# EAGLE design SensorMoteSMT_V1.1MCAD (EAGLE 6.2)

## Sheet 1 of 4
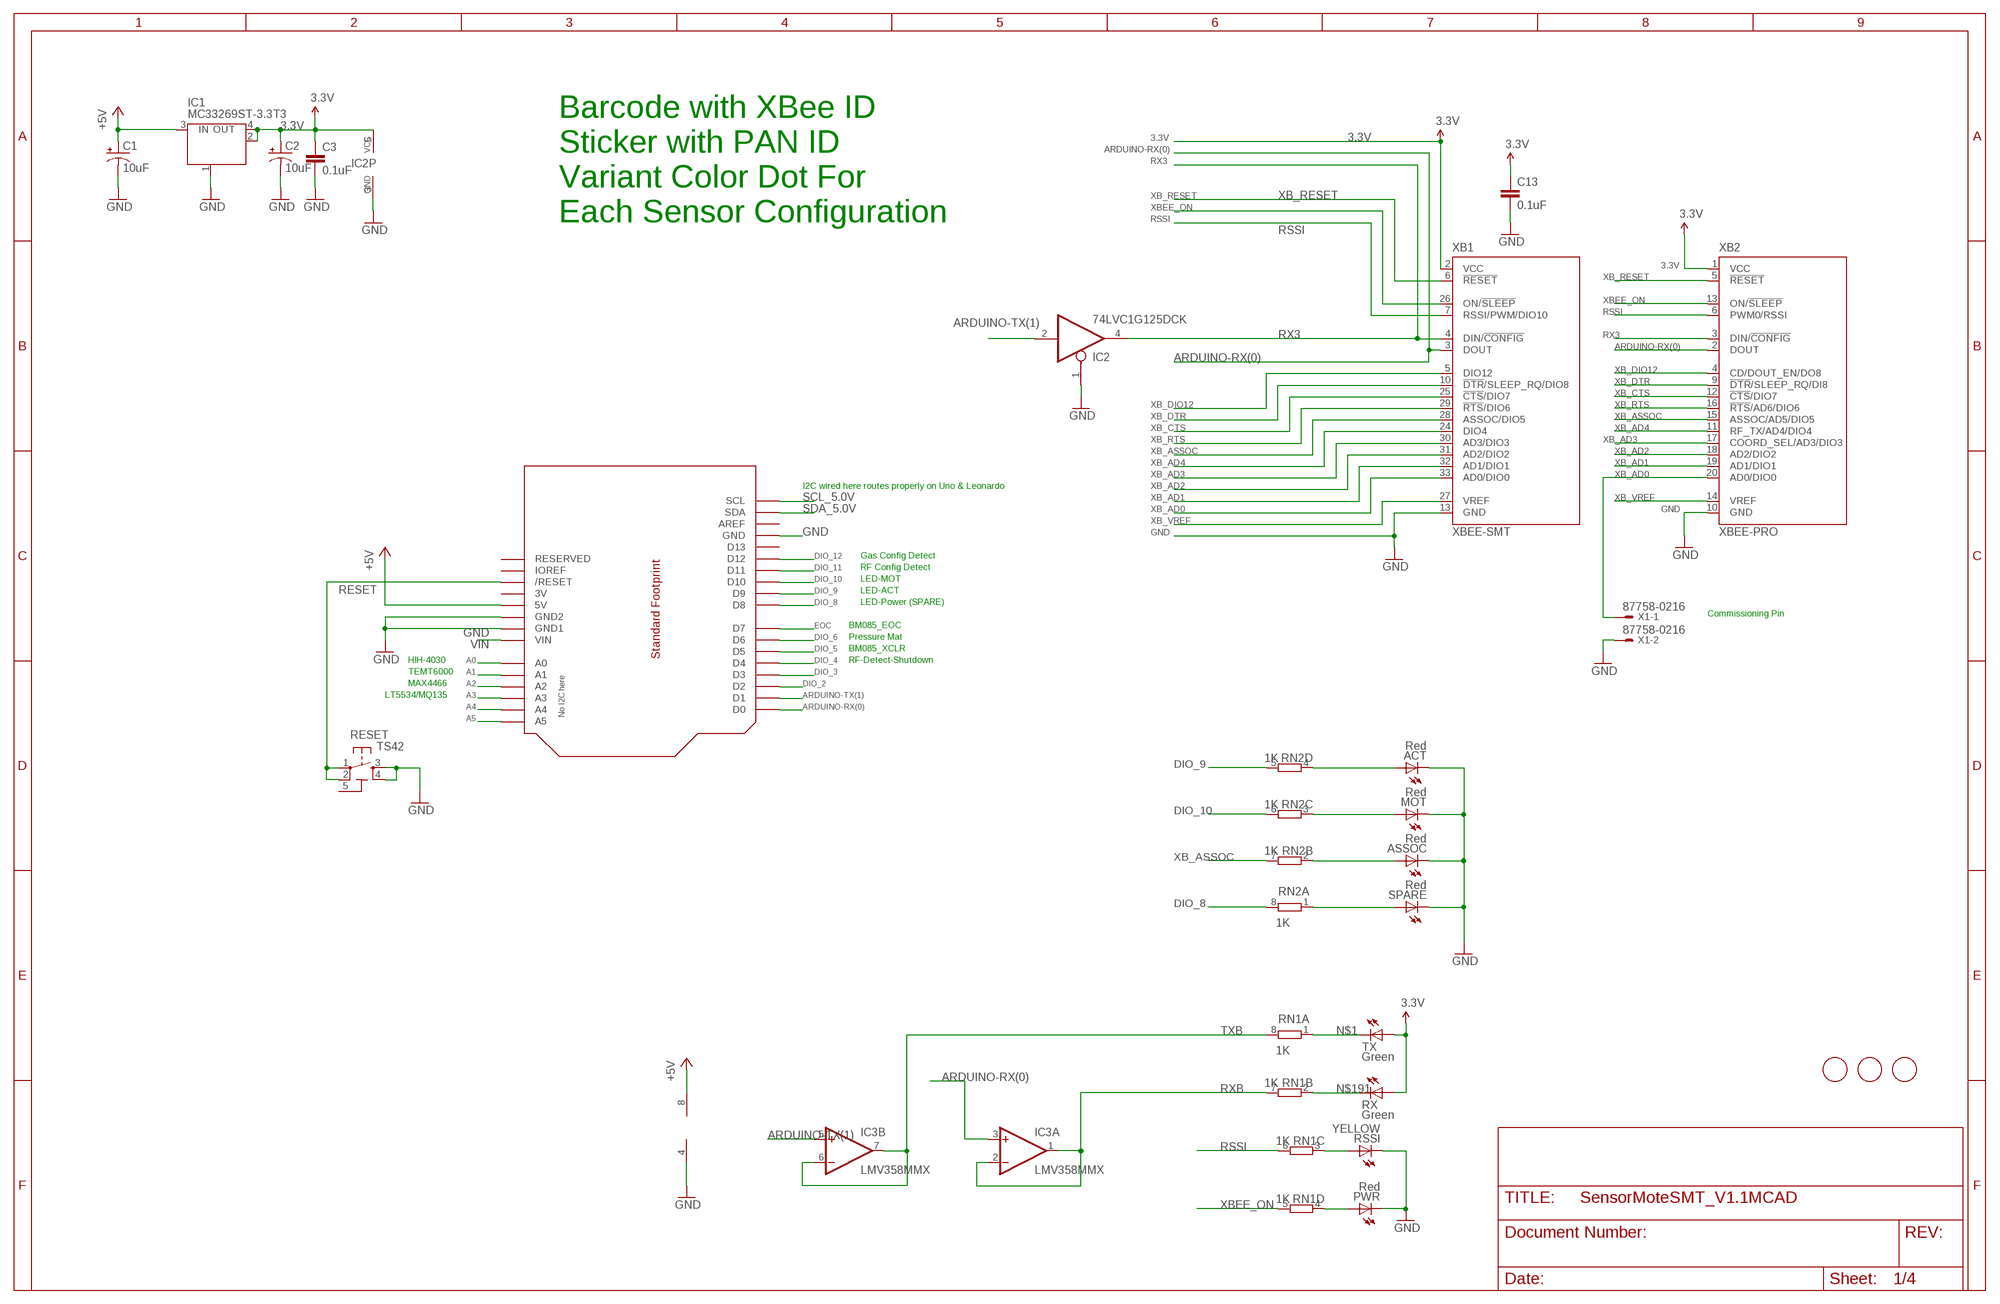
[diagram p0: schematic, sheet 1]

### Parts
A1  FIDUCIALMOUNT  [FIDUCIA-MOUNT]
A2  FIDUCIALMOUNT  [FIDUCIA-MOUNT]
A3  FIDUCIALMOUNT  [FIDUCIA-MOUNT]
ACT  Red  LEDCHIP-LED0805  [CHIP-LED0805]
ASSOC  Red  LEDCHIP-LED0805  [CHIP-LED0805]
C1  10uF  CAP_POL1206  [EIA3216]
C2  10uF  CAP_POL1206  [EIA3216]
C3  0.1uF  C-EUC0805K  [C0805K]
C13  0.1uF  C-EUC0805K  [C0805K]
IC1  MC33269ST-3.3T3  [SOT223]
IC2  74LVC1G125DCK  [SC70-5]
IC3  LMV358MMX  [MSOP08]
MOT  Red  LEDCHIP-LED0805  [CHIP-LED0805]
PWR  Red  LEDCHIP-LED0805  [CHIP-LED0805]
RESET  TS42  [TS42]
RN1  1K  4R-NCAY16  [CAY16]
RN2  1K  4R-NCAY16  [CAY16]
RSSI  YELLOW  LEDCHIP-LED0805  [CHIP-LED0805]
RX  Green  LEDCHIP-LED0805  [CHIP-LED0805]
SPARE  Red  LEDCHIP-LED0805  [CHIP-LED0805]
TX  Green  LEDCHIP-LED0805  [CHIP-LED0805]
U1  ARDUINOR3  [ARDUINOR3_EXTENDED]
X1  87758-0216  [87758-0216]
XB1  XBEE-SMT  [XBEE-SMT]
XB2  XBEE-PRO  [XBEE-PRO]

### Nets
3.3V: C2.A(+) C3.1 C13.1 IC1.2(OUT) IC1.4(OUT) IC2.5(VCC) RX.A TX.A XB1.2(VCC) XB2.1(VCC) ; also sheet 3
+5V: C1.A(+) IC1.3(IN) IC3.8(P:V+) U1.5V ; also sheet 2,3,4
A0: U1.A0 ; also sheet 2
A1: U1.A1 ; also sheet 2
A2: U1.A2 ; also sheet 3
A3: U1.A3 ; also sheet 4
A4: U1.A4
A5: U1.A5
ARDUINO-RX(0): IC3.3(A:+IN) U1.D0 XB1.3(DOUT) XB2.2(DOUT)
ARDUINO-TX(1): IC2.2(I) IC3.5(B:+IN) U1.D1
DIO_2: U1.D2
DIO_3: U1.D3
DIO_4: U1.D4 ; also sheet 4
DIO_5: U1.D5 ; also sheet 3
DIO_6: U1.D6 ; also sheet 4
DIO_8: RN2.8 U1.D8
DIO_9: RN2.5 U1.D9
DIO_10: RN2.6 U1.D10
DIO_11: U1.D11 ; also sheet 4
DIO_12: U1.D12 ; also sheet 4
EOC: U1.D7 ; also sheet 3
GND: ACT.C ASSOC.C C1.C(-) C2.C(-) C3.2 C13.2 IC1.1(GND/ADJ) IC2.1(OE) IC2.3(GND) IC3.4(P:V-) MOT.C PWR.C RESET.3 RESET.4 RSSI.C SPARE.C U1.GND U1.GND1 U1.GND2 X1.2 XB1.13(GND) XB2.10(GND) ; also sheet 2,3,4
N$1: RN1.1 TX.C
N$11: ACT.A RN2.4
N$15: MOT.A RN2.3
N$16: RN1.3 RSSI.A
N$18: ASSOC.A RN2.2
N$19: RN2.1 SPARE.A
N$29: PWR.A RN1.4
N$191: RN1.2 RX.C
RESET: RESET.1 RESET.2 U1.RESET(/RESET)
RSSI: RN1.6 XB1.7(RSSI/PWM/DIO10) XB2.6(PWM0/RSSI)
RX3: IC2.4(O) XB1.4(DIN/!CONFIG) XB2.3(DIN/!CONFIG)
RXB: IC3.1(A:OUT) IC3.2(A:-IN) RN1.7
SCL_5.0V: U1.SCL ; also sheet 3
SDA_5.0V: U1.SDA ; also sheet 3
TXB: IC3.6(B:-IN) IC3.7(B:OUT) RN1.8
VIN: U1.VIN
XB_AD0: X1.1 XB1.33(AD0/DIO0) XB2.20(AD0/DIO0)
XB_AD1: XB1.32(AD1/DIO1) XB2.19(AD1/DIO1)
XB_AD2: XB1.31(AD2/DIO2) XB2.18(AD2/DIO2)
XB_AD3: XB1.30(AD3/DIO3) XB2.17(COORD_SEL/AD3/DIO3)
XB_AD4: XB1.24(DIO4) XB2.11(RF_TX/AD4/DIO4)
XB_ASSOC: RN2.7 XB1.28(ASSOC/DIO5) XB2.15(ASSOC/AD5/DIO5)
XB_CTS: XB1.25(!CTS!/DIO7) XB2.12(!CTS!/DIO7)
XB_DIO12: XB1.5(DIO12) XB2.4(CD/DOUT_EN/DO8)
XB_DTR: XB1.10(!DTR!/SLEEP_RQ/DIO8) XB2.9(!DTR!/SLEEP_RQ/DI8)
XB_RESET: XB1.6(!RESET) XB2.5(!RESET)
XB_RTS: XB1.29(!RTS!/DIO6) XB2.16(!RTS!/AD6/DIO6)
XB_VREF: XB1.27(VREF) XB2.14(VREF)
XBEE_ON: RN1.5 XB1.26(ON/!SLEEP) XB2.13(ON/!SLEEP)
Unconnected: U1.AREF U1.D13 U1.IOREF U1.RESERVED

### Notes on the sheet
- Barcode with XBee ID
- Sticker with PAN ID
- Variant Color Dot For
- Each Sensor Configuration
- I2C wired here routes properly on Uno & Leonardo
- Gas Config Detect
- RF Config Detect
- LED-MOT
- LED-ACT
- LED-Power (SPARE)
- Commissioning Pin
- BM085_EOC
- Pressure Mat
- BM085_XCLR
- HIH-4030 | RF-Detect-Shutdown
- TEMT6000
- MAX4466
- LT5534/MQ135

## Sheet 2 of 4: Sparkfun Parts
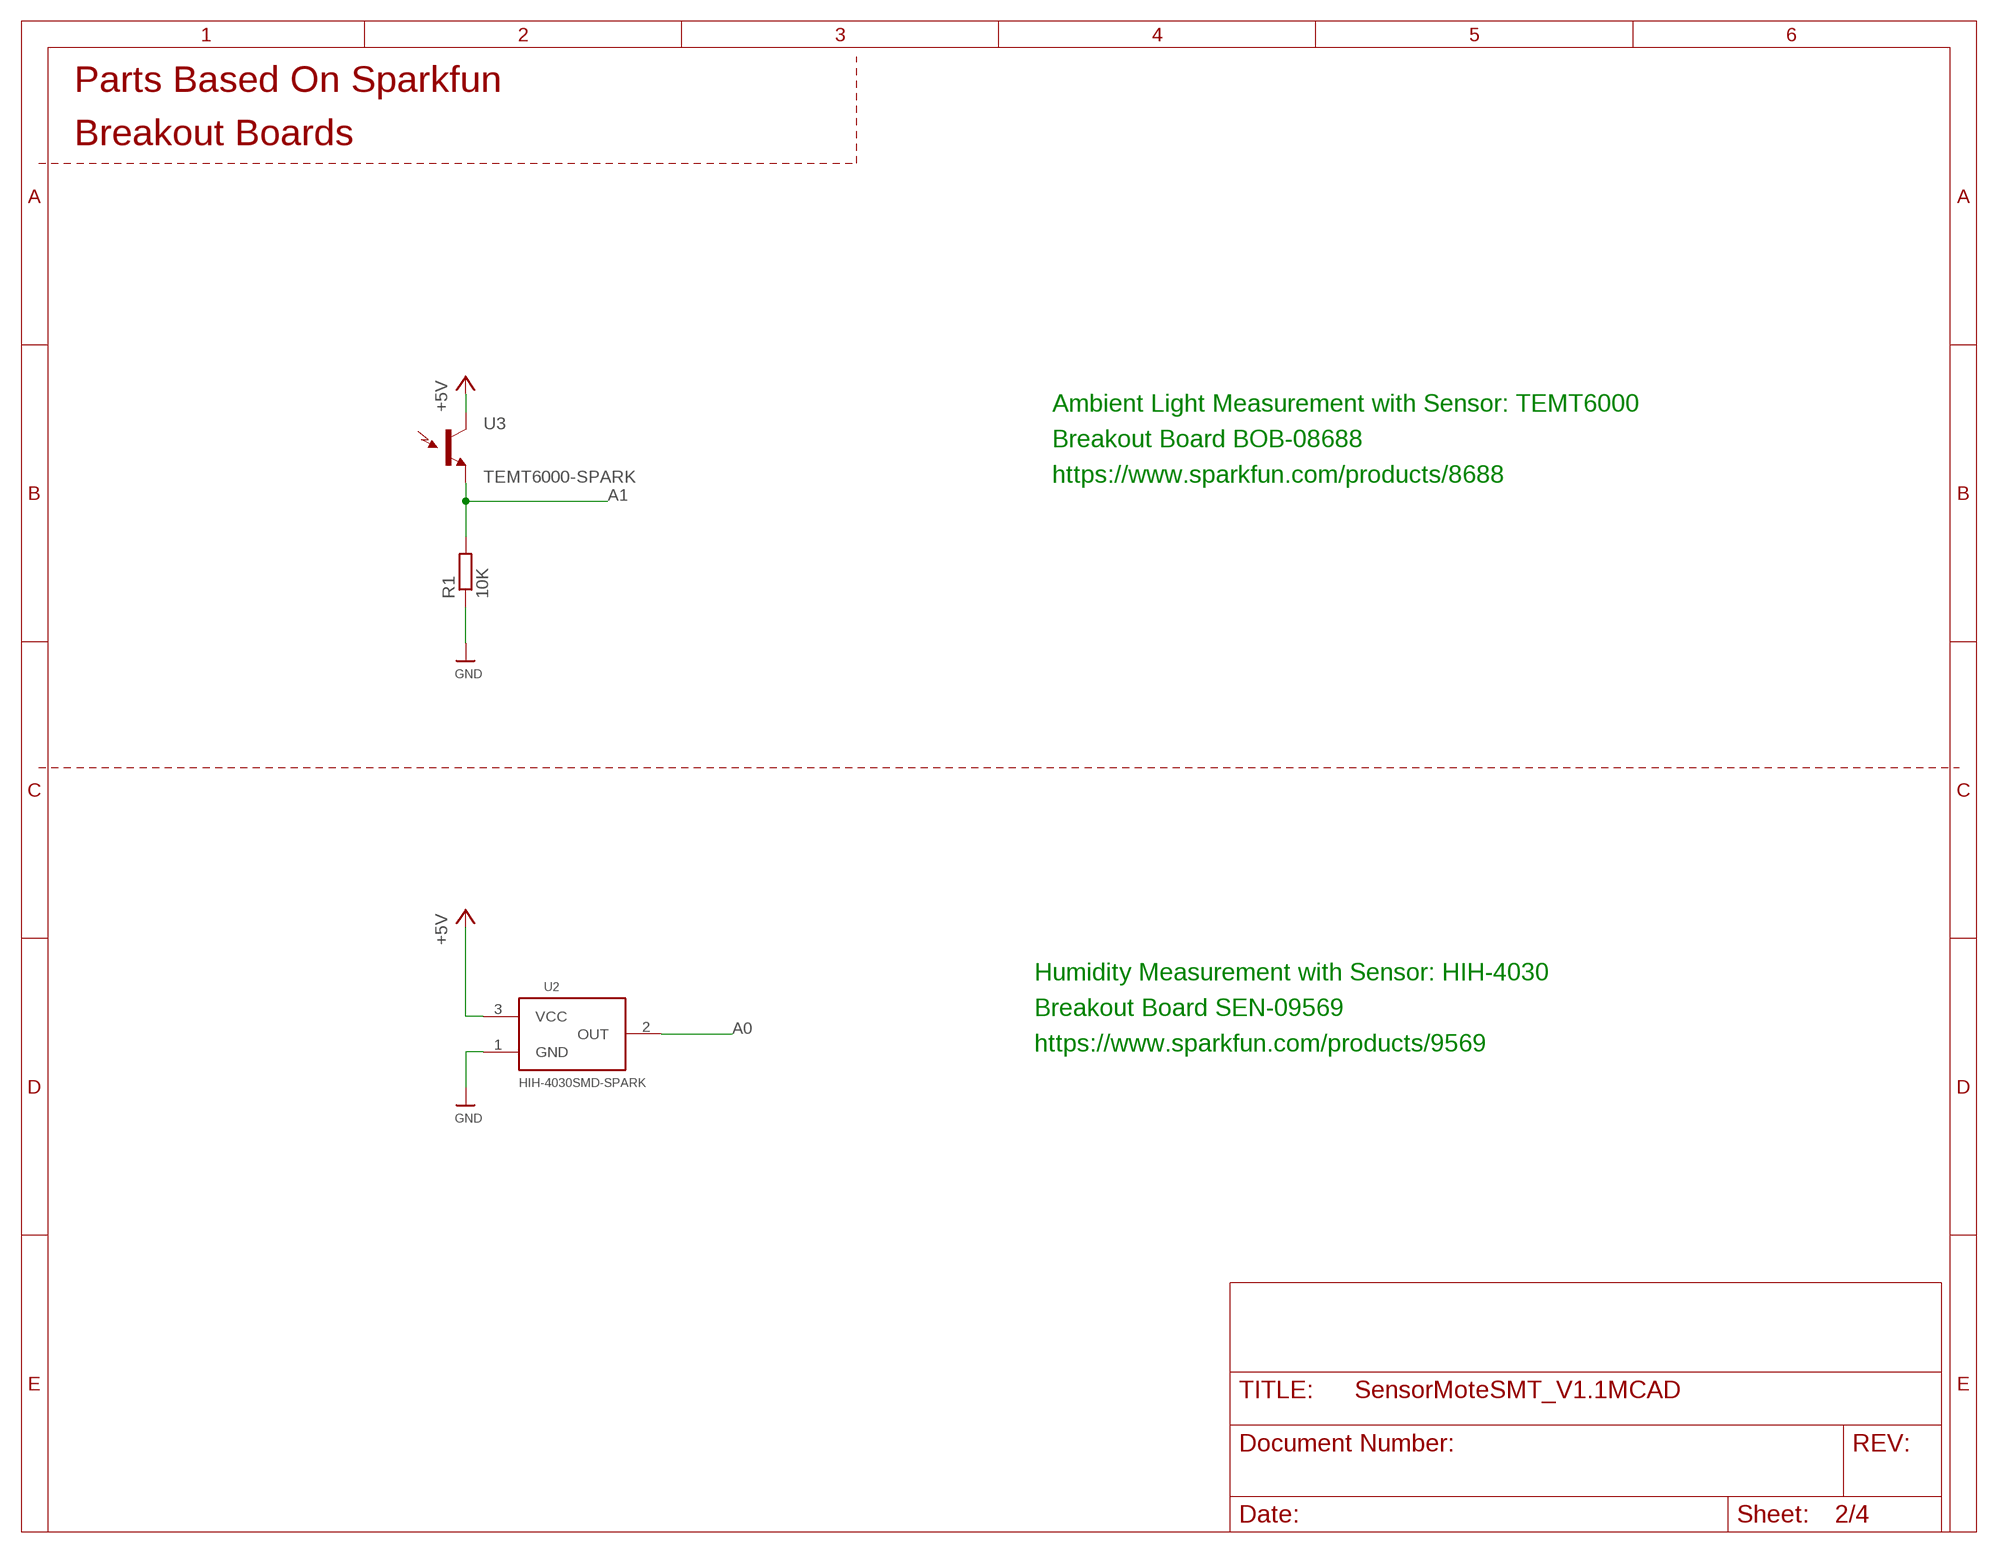
[diagram p1: schematic, sheet 2]

### Parts
R1  10K  R-EU_R0805  [R0805]
U2  HIH-4030SMD-SPARK  HIH-4030SMD  [HIH-4030]
U3  TEMT6000-SPARK  TEMT6000  [TEMT6000-SEN]

### Nets
+5V: U2.3(VCC) U3.COLLECTOR(C1) ; also sheet 1,3,4
A0: U2.2(OUT) ; also sheet 1
A1: R1.2 U3.EMITTER(E1) ; also sheet 1
GND: R1.1 U2.1(GND) ; also sheet 1,3,4

### Notes on the sheet
- Parts Based On Sparkfun
- Breakout Boards
- Ambient Light Measurement with Sensor: TEMT6000
- Breakout Board BOB-08688
- https://www.sparkfun.com/products/8688
- Humidity Measurement with Sensor: HIH-4030
- Breakout Board SEN-09569
- https://www.sparkfun.com/products/9569

## Sheet 3 of 4: Adafruit Parts
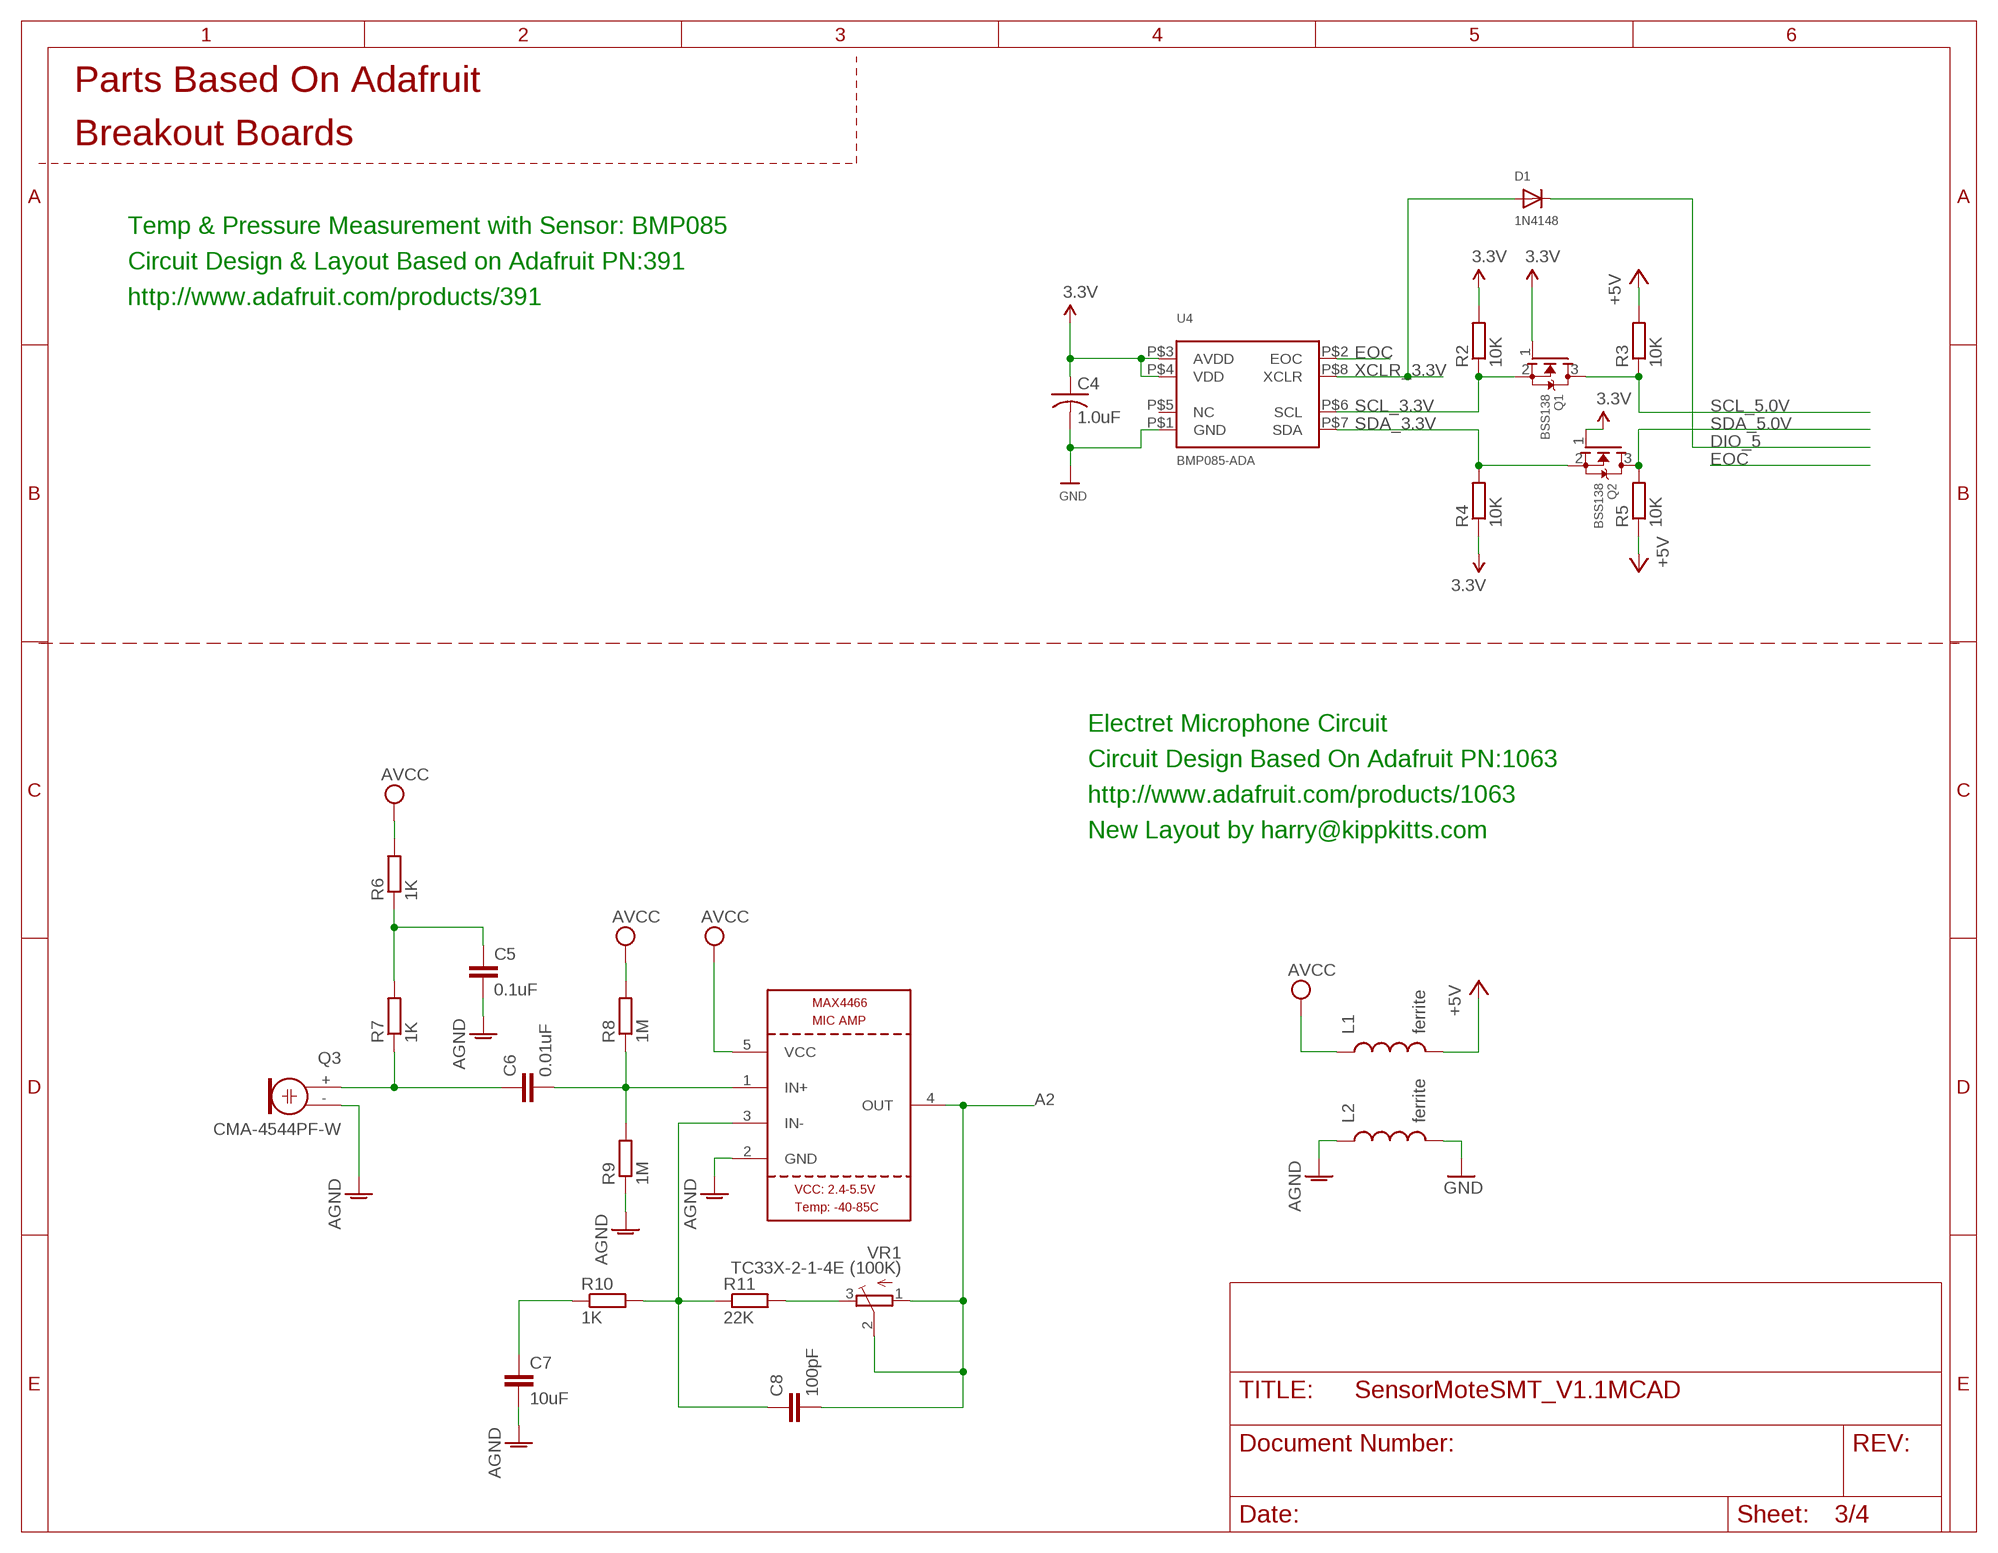
[diagram p2: schematic, sheet 3]

### Parts
C4  1.0uF  C-USC0805K  [C0805K]
C5  0.1uF  C-EUC0805K  [C0805K]
C6  0.01uF  C-EUC0805K  [C0805K]
C7  10uF  C-EUC0805K  [C0805K]
C8  100pF  C-EUC0805K  [C0805K]
D1  1N4148  DIODESOD-323F  [SOD-323F]
L1  ferrite  INDUCTOR0603  [0603]
L2  ferrite  INDUCTOR0603  [0603]
Q1  BSS138  MOSFET-NREFLOW  [SOT23]
Q2  BSS138  MOSFET-NREFLOW  [SOT23]
Q3  CMA-4544PF-W  ELECTRET  [9.7ELECTRET]
R2  10K  R-EU_R0805  [R0805]
R3  10K  R-EU_R0805  [R0805]
R4  10K  R-EU_R0805  [R0805]
R5  10K  R-EU_R0805  [R0805]
R6  1K  R-EU_R0805  [R0805]
R7  1K  R-EU_R0805  [R0805]
R8  1M  R-EU_R0805  [R0805]
R9  1M  R-EU_R0805  [R0805]
R10  1K  R-EU_R0805  [R0805]
R11  22K  R-EU_R0805  [R0805]
U4  BMP085-ADA  BMP085  [BMP085]
U5  MAX4466SC70  [SC70-5L]
VR1  TC33X-2-1-4E (100K)  TRIMPOTTC33X  [TC33X]

### Nets
3.3V: C4.1 Q1.1(G) Q2.1(G) R2.2 R4.1 U4.P$3(AVDD) U4.P$4(VDD) ; also sheet 1
+5V: L1.2 R3.2 R5.1 ; also sheet 1,2,4
A2: C8.2 U5.4(OUT) VR1.1(A) VR1.2(S) ; also sheet 1
AGND: C5.2 C7.2 L2.1 Q3.- R9.1 U5.2(GND)
DIO_5: D1.C ; also sheet 1
EOC: U4.P$2(EOC) ; also sheet 1
GND: C4.2 L2.2 U4.P$1(GND) ; also sheet 1,2,4
N$2: C6.1 Q3.+ R7.1
N$6: C6.2 R8.1 R9.2 U5.1(IN+)
N$7: C5.1 R6.1 R7.2
N$8: C8.1 R10.2 R11.1 U5.3(IN-)
N$9: C7.1 R10.1
N$10: R11.2 VR1.3(E)
SCL_3.3V: Q1.2(S) R2.1 U4.P$6(SCL)
SCL_5.0V: Q1.3(D) R3.1 ; also sheet 1
SDA_3.3V: Q2.2(S) R4.2 U4.P$7(SDA)
SDA_5.0V: Q2.3(D) R5.2 ; also sheet 1
VCC: L1.1 R6.2 R8.2 U5.5(VCC) ; supply symbol labelled AVCC
XCLR_3.3V: D1.A U4.P$8(XCLR)
Unconnected: U4.P$5(NC)

### Notes on the sheet
- Parts Based On Adafruit
- Breakout Boards
- Temp & Pressure Measurement with Sensor: BMP085
- Circuit Design & Layout Based on Adafruit PN:391
- http://www.adafruit.com/products/391
- Electret Microphone Circuit
- Circuit Design Based On Adafruit PN:1063
- http://www.adafruit.com/products/1063
- New Layout by harry@kippkitts.com

## Sheet 4 of 4: Other_Sensors
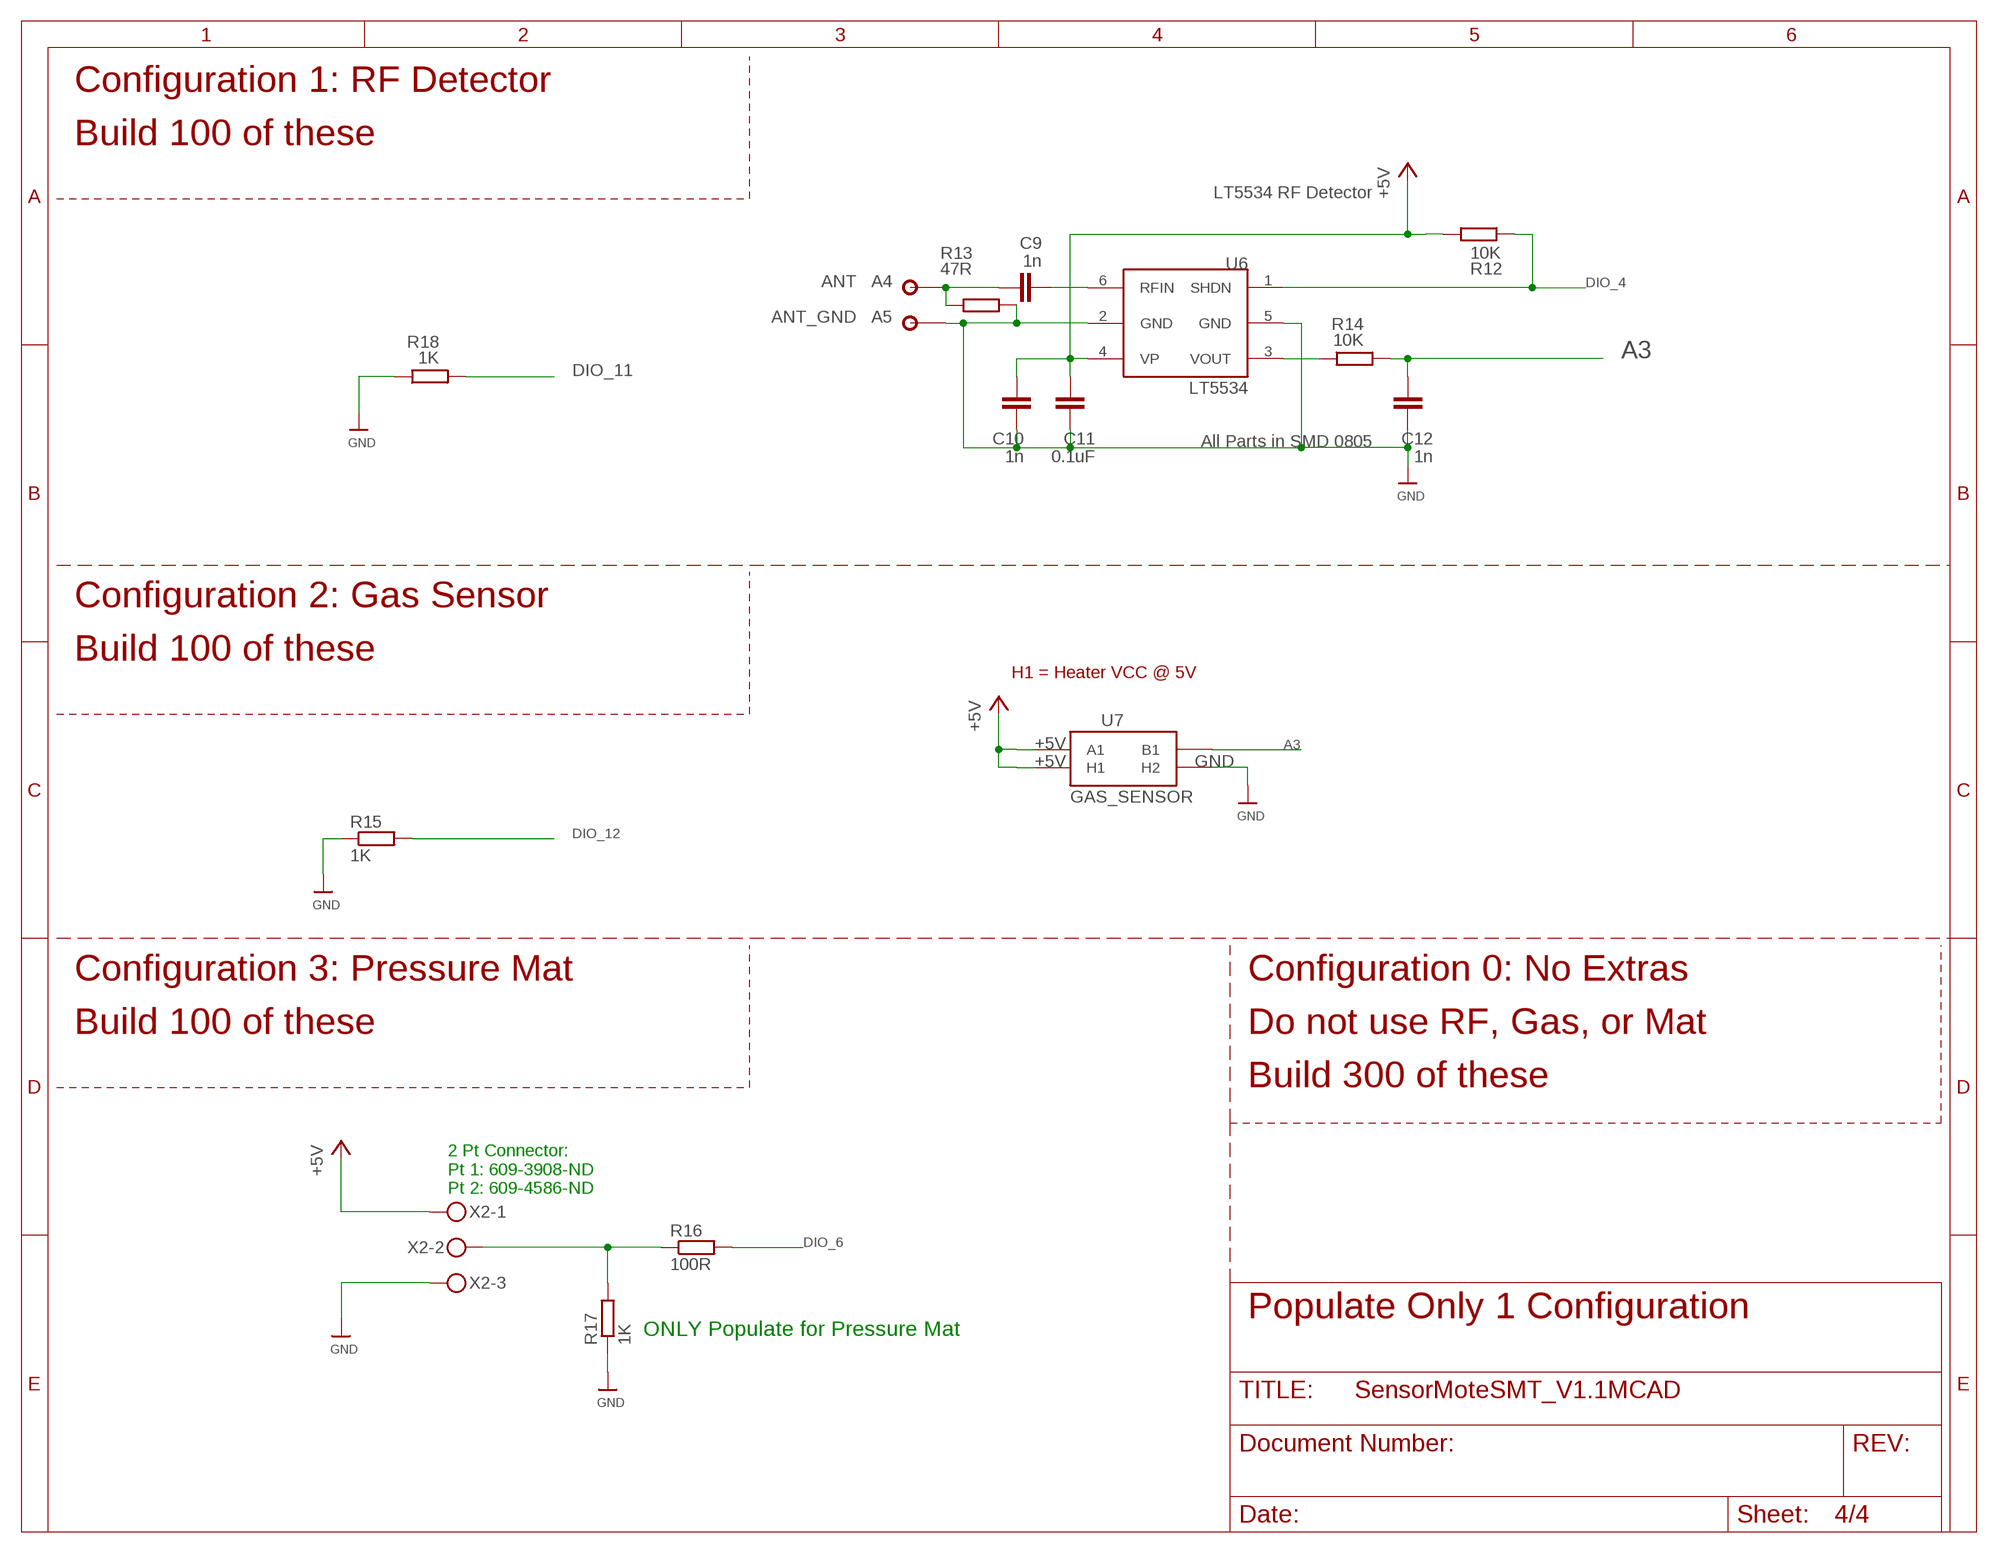
[diagram p3: schematic, sheet 4]

### Parts
A4  ANT  PAD1,46MM  [PAD146]
A5  ANT_GND  PAD1,46MM  [PAD146]
C9  1n  C-EUC0805K  [C0805K]
C10  1n  C-EUC0805K  [C0805K]
C11  0.1uF  C-EUC0805K  [C0805K]
C12  1n  C-EUC0805K  [C0805K]
R12  10K  R-EU_R0805  [R0805]
R13  47R  R-EU_R0805  [R0805]
R14  10K  R-EU_R0805  [R0805]
R15  1K  R-EU_R0805  [R0805]
R16  100R  R-EU_R0805  [R0805]
R17  1K  R-EU_R0805  [R0805]
R18  1K  R-EU_R0805  [R0805]
U6  LT5534  LTC55  [SC70]
U7  GAS_SENSOR  [MQ-3]
X2  MKDSN1,5/3-5,08  [MKDSN1,5/3-5,08]

### Nets
+5V: C10.2 C11.2 R12.2 U6.4(VP) U7.A1 U7.HA(H1) X2.1 ; also sheet 1,2,3
A3: C12.2 R14.2 U7.B1 ; also sheet 1
DIO_4: R12.1 U6.1(SHDN) ; also sheet 1
DIO_6: R16.2 ; also sheet 1
DIO_11: R18.2 ; also sheet 1
DIO_12: R15.2 ; also sheet 1
GND: A5.1 C10.1 C11.1 C12.1 R13.2 R15.1 R17.1 R18.1 U6.2(GND) U6.5(GND) U7.HB(H2) X2.3 ; also sheet 1,2,3
N$12: C9.1 U6.6(RFIN)
N$13: A4.1 C9.2 R13.1
N$14: R14.1 U6.3(VOUT)
N$20: R16.1 R17.2 X2.2

### Notes on the sheet
- Configuration 1: RF Detector
- Build 100 of these
- LT5534 RF Detector
- All Parts in SMD 0805
- Configuration 2: Gas Sensor
- ALSO POPULATE C12 USING 10K RESISTOR
- Build 100 of these
- H1 = Heater VCC @ 5V
- Configuration 3: Pressure Mat | Configuration 0: No Extras
- Build 100 of these | Do not use RF, Gas, or Mat
- Build 300 of these
- 2 Pt Connector:
  Pt 1: 609-3908-ND
  Pt 2: 609-4586-ND
- Populate Only 1 Configuration
- ONLY Populate for Pressure Mat

## Power pins joined to a net without a drawn wire
3V: U1.3V
5-GND: RESET.5(5-GND)

## Library data of the parts
A1-A3 = Smartprj:FIDUCIALMOUNT
A4 A5 = 1martin:PAD
ACT ASSOC MOT PWR RSSI RX SPARE TX = led:LED: LED OSRAM: - CHIPLED LG R971, LG N971, LY N971, LG Q971, LY Q971, LO R971, LY R971 LH N974, LH R974 LS Q976, LO Q976, LY Q976 LO Q996 - Hyper CHIPLED LW Q18S LB Q993, LB Q99A, LB R99A - SideLED LS A670, LO A670, LY A670, LG A670, LP A670 LB A673, LV A673, LT A673, LW A673 LH A674 LY A675 LS A676, LA A676, LO A676, LY A676, LW A676 LS A679, LY A679, LG A679 - Hyper Micro SIDELED® LS Y876, LA Y876, LO Y876, LY Y876 LT Y87S - SmartLED LW L88C, LW L88S LB L89C, LB L89S, LG L890 LS L89K, LO L89K, LY L89K LS L896, LA L896, LO L896, LY L896 - TOPLED LS T670, LO T670, LY T670, LG T670, LP T670 LSG T670, LSP T670, LSY T670, LOP T670, LYG T670 LG T671, LOG T671, LSG T671 LB T673, LV T673, LT T673, LW T673 LH T674 LS T676, LA T676, LO T676, LY T676, LB T676, LH T676, LSB T676, LW T676 LB T67C, LV T67C, LT T67C, LS T67K, LO T67K, LY T67K, LW E67C LS E67B, LA E67B, LO E67B, LY E67B, LB E67C, LV E67C, LT E67C LW T67C LS T679, LY T679, LG T679 LS T770, LO T770, LY T770, LG T770, LP T770 LB T773, LV T773, LT T773, LW T773 LH T774 LS E675, LA E675, LY E675, LS T675 LS T776, LA T776, LO T776, LY T776, LB T776 LHGB T686 LT T68C, LB T68C - Hyper Mini TOPLED® LB M676 - Mini TOPLED Santana® LG M470 LS M47K, LO M47K, LY M47K Source: http://www.osram.convergy.de LUXEON: - LUMILED® LXK2-PW12-R00, LXK2-PW12-S00, LXK2-PW14-U00, LXK2-PW14-V00 LXK2-PM12-R00, LXK2-PM12-S00, LXK2-PM14-U00 LXK2-PE12-Q00, LXK2-PE12-R00, LXK2-PE12-S00, LXK2-PE14-T00, LXK2-PE14-U00 LXK2-PB12-K00, LXK2-PB12-L00, LXK2-PB12-M00, LXK2-PB14-N00, LXK2-PB14-P00, LXK2-PB14-Q00 LXK2-PR12-L00, LXK2-PR12-M00, LXK2-PR14-Q00, LXK2-PR14-R00 LXK2-PD12-Q00, LXK2-PD12-R00, LXK2-PD12-S00 LXK2-PH12-R00, LXK2-PH12-S00 LXK2-PL12-P00, LXK2-PL12-Q00, LXK2-PL12-R00 Source: www.luxeon.com KINGBRIGHT: KA-3528ASYC Source: www.kingbright.com
C1 C2 = SparkFun:CAP_POL: Capacitor Polarized These are standard SMD and PTH capacitors. Normally 10uF, 47uF, and 100uF in electrolytic and tantalum varieties. Always verify the external diameter of the through hole cap, it varies with capacity, voltage, and manufacturer. The EIA devices should be standard.
C3 C5-C13 = rcl:C-EU: CAPACITOR, European symbol
C4 = adafruit:C-US: CAPACITOR, American symbol
D1 = adafruit:DIODE: Diode SMADIODE - SMA Surface Mount Package 20V 1A Schottky Diode Digikey: 641-1014-6-ND DO-1N4148 - Through Hole Small Current Diode SOD-123 20V 1 A (.5mV Vf) Schottky Diode - Digikey: MBRX120TPMSCT-ND SOD-323 10V 570mA (.38mV Vf, 3ns) Schottky Diode - Digikey: ZLLS410CT-ND SOD-523 30V 30mA Schottky Diode (RB751S-40TE61) - Digikey: RB751S-40TE61CT-ND SOT23-R/W - SOT23 Package (R = Solder Paste/Reflow Ovens, W = Hand-Soldering) BAT54Film 40V 300mA - Digikey: 497-7162-1-ND
IC1 = linear:MC33269ST*: Adjustable Output Low Dropout Voltage Regulator 800 mA Source: http://www.onsemi.com/pub/Collateral/MC33269-D.PDF
IC2 = 74xx-little-us:74*1G125: Single Bus Buffer Gate with 3-State Output
IC3 = linear:LMV358?*: Dual General Purpose, Low Voltage, Rail-to-Rail Output Operational Amplifiers Source: http://www.national.com/mpf/LM/LMV321.html http://www.national.com/dt/lmv_qual.pdf
L1 L2 = SparkFun:INDUCTOR: Inductors Basic Inductor/Choke - 0603 and 1206. Footprints are not proven and vary greatly between part numbers.
Q1 Q2 = adafruit:MOSFET-N: N-Channel Mosfet 2N7002E - 60V 260mA SOT23 [Digikey: 2N7002ET1GOSTR-ND] - REEL BSH103 - 30V 850mA SOT23 [Digikey: 568-5013-1-ND]
Q3 = adafruit:ELECTRET: Electret microphone Thru hole 2.54mm spacing with 9.7mm diameter
R1-R11 = resistor:R-EU_: RESISTOR, European symbol
R12-R18 = rcl:R-EU_: RESISTOR, European symbol
RESET = st-mod v1.4:TS42: TS42 Dongnan Electronics Tact switch VDC 12V - 50mA
RN1 RN2 = resistor-dil:4R-N: Array Chip Resistor Source: RS Component / Phycomp; OC_FARNELL: unknown; OC_NEWARK: unknown
U1 = KippKitts:ARDUINOR3: This is a new object for the new Arduino R3 - with extra pins that you may want to use (such as IOref, and duplicated A4/A5
U2 = SparkFun:HIH-4030: Humidity Sensor
U3 = SparkFun:TEMT6000: Ambient Light Sensor Simple light detection sensor. Output varies with light intensity input. Spark Fun Electronics SKU : COM-08348
U4 = microbuilder:BMP085: BMP085 Digital Pressure Sensor 1.8-3.6V Supply, I2C Interface
U5 = KippKitts:MAX4466: MAX4466 Mic Amp
U6 = 1martin:LTC55
U7 = SparkFun:GAS_SENSOR: MQ-3 Gas Sensor. FP not tested. Part#
VR1 = adafruit:TRIMPOT: SMT trimmer potentiometer part number TC33X http://www.ladyada.net/library/eagle
X1 = con-molex:87758-0216: 2 Pin - 2mm Dual Row Single Wafer, Vertical T/H HDR Source: http://www.molex.com/pdm_docs/sd/877580616_sd.pdf; MPN: 87758-0216; OC_FARNELL: unknown; OC_NEWARK: 94M1513
X2 = con-phoenix-508:MKDSN1,5/3-5,08: MKDSN 1,5/ 3-5,08 Printklemme Nennstrom: 13,5 A Nennspannung: 250 V Rastermaß: 5,08 mm Polzahl: 3 Anschlussart: Schraubanschluss Montage: Löten Anschlussrichtung Leiter/Platine: 0 ° Artikelnummer: 1729131 Source: http://eshop.phoenixcontact.com .. 1729131.pdf; MPN: SMKDSN1,5/3-5,08; OC_FARNELL: 1792904; OC_NEWARK: 70R0299
XB1 = xbee:XBEE-SMT: XBee(TM)/XBee-PRO(TM) ZB SMT RF Modules. Source: Digi (90002002_a.pdf) (http://www.digi.com/products/wireless-wired-embedded-solutions/zigbee-rf-modules/zigbee-mesh-module/xbee-smt.jsp#overview)
XB2 = maxstream:XBEE: XBee (TM) /XBee-PRO(TM) OEM RF Modules Source: MaxStream, Inc. xbee_productmanual.pdf; MPN: XBP24-AWI-001; OC_FARNELL: 1337916; OC_NEWARK: 42M2667

## Net classes
0 default: width 0.203 mm, drill 0.305 mm, clearance 0.203 mm
2 gnd: width 0.203 mm, drill 0.305 mm, clearance 0.203 mm

## Board
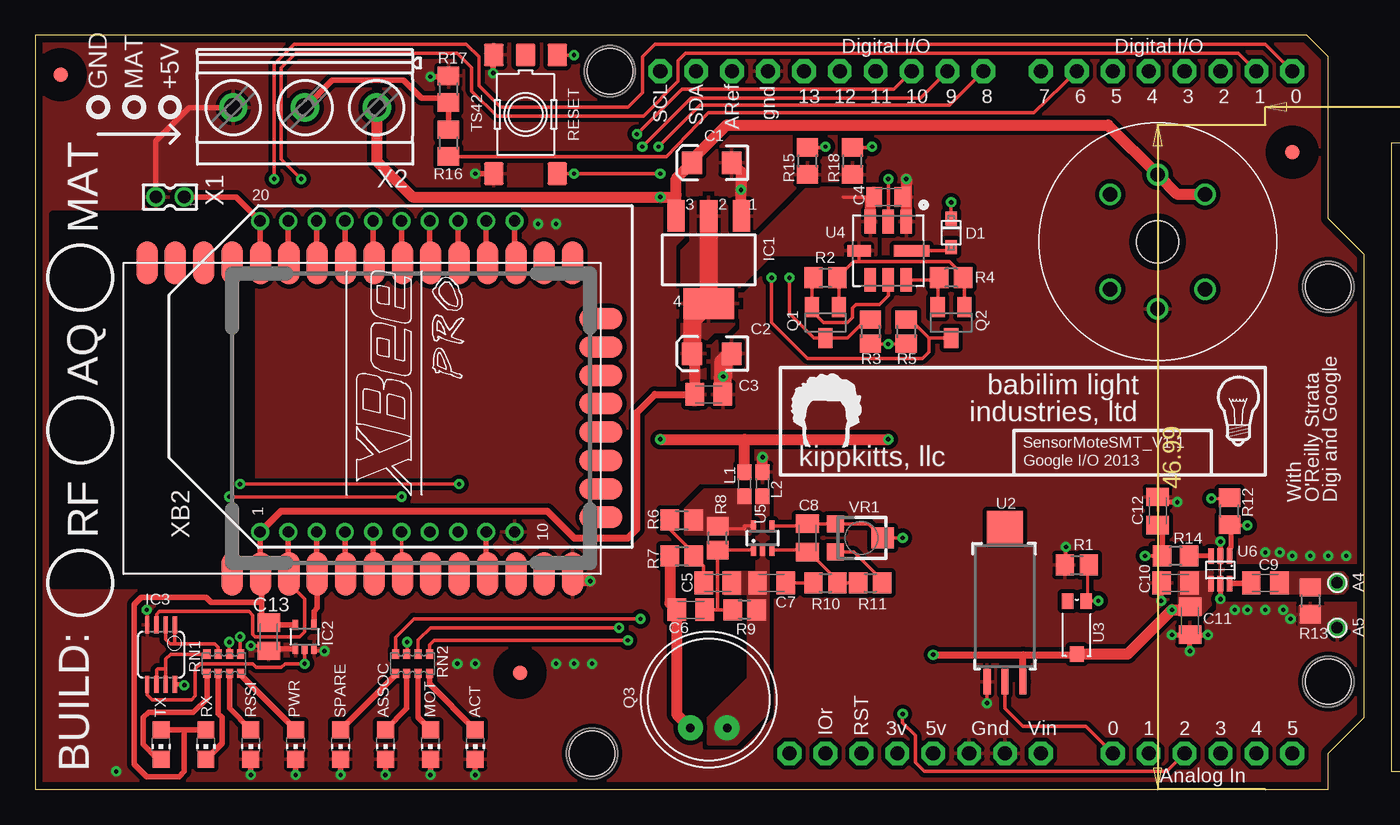
[diagram p4: board, top side]
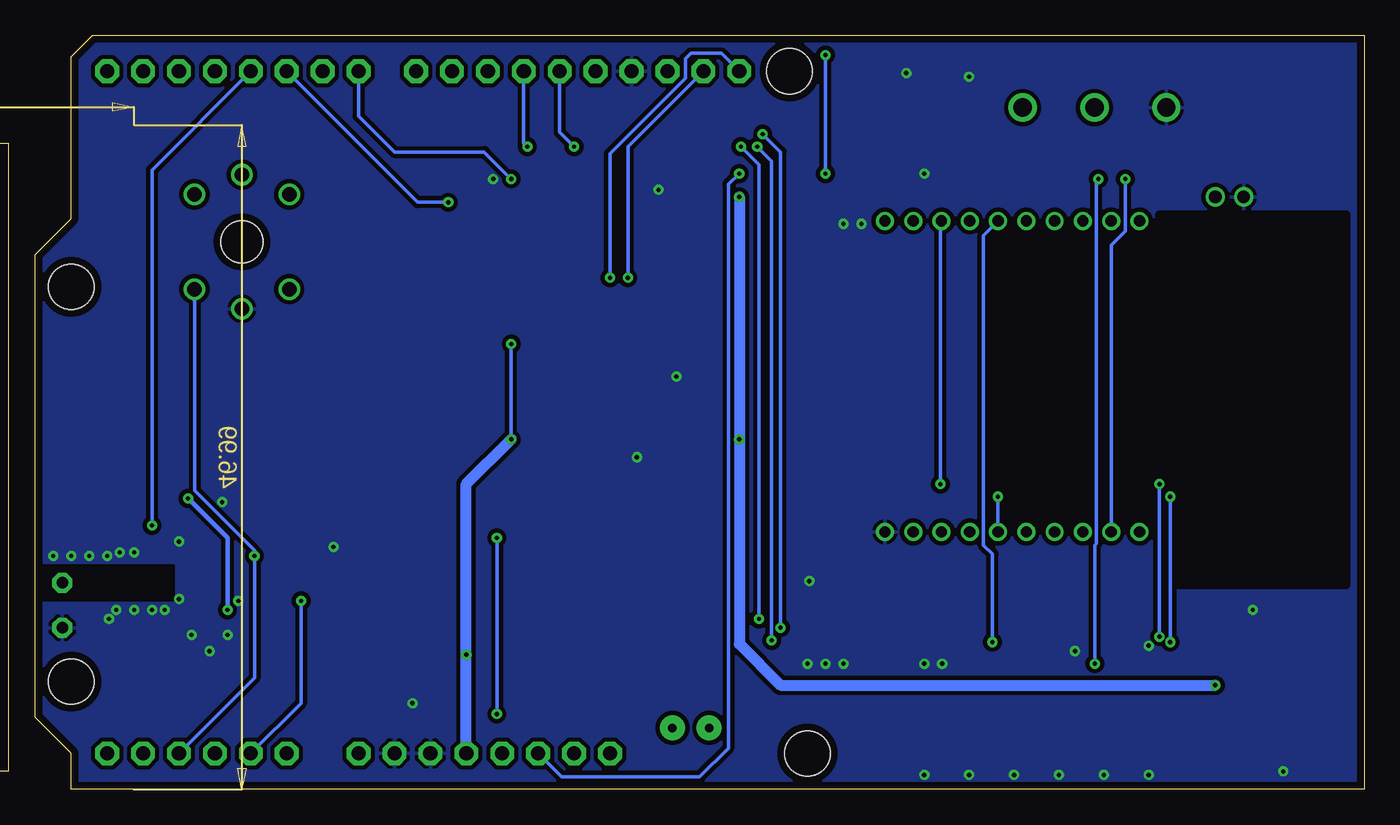
[diagram p5: board, bottom side, seen from below]

Size 93.98 x 53.34 mm. Coordinates in mm from the lower left corner, seen from the top.
Copper layers (1*16): Top 0.0178mm / dielectric 59mil / Bottom 0.0178mm
Design rules: minimum track width 6mil, minimum drill 14mil, track to track 6mil, track to pad 6mil, pad to pad 6mil, via to via 6mil, smd to smd 6mil, copper to edge 20mil, drill to drill 16mil, minimum pad ring 8mil, minimum via ring 8mil, stop-mask expansion 3mil, vias tented up to drill 0mil, thermal gap 10mil
Holes 3.2 mm at 40.64,50.8 91.44,7.62 91.44,35.56 39.37,2.54
tRestrict: area 1.3,14.5 to 15.2,40.6
bRestrict: area 1.3,14.5 to 14.5,40.6
Milling: area 95.9,1.3 to 118.1,45.7; area 79.1,45.5 to 79.7,47; area 79.1,0 to 79.7,1.5; area 79.8,21 to 81,26; area 125.5,48 to 127,48.6; area 87,48 to 88.5,48.6; area 106,46.6 to 108,47.9; 6 lines

### Footprints (pad centres in the part's own frame; a part is rotated, then mirrored left to right if it is on the bottom)
FIDUCIA-MOUNT = smd 1.016 x 1.016: P$1 0,0
PAD146 = drill 0.813 pad 1.422 octagon: 1 0,0
CHIP-LED0805 = smd 1.2 x 1.2: A 0,-1.05; C 0,1.05
EIA3216 = smd 1.4 x 1.6: A 1.4,0; C -1.4,0
C0805K = smd 1.3 x 1.6: 1 -1,0; 2 1,0
C0805K' = smd 1.1 x 1.4: 1 -1,0; 2 1,0
SOD-323F = smd 1 x 0.8: A -1,0; C 1,0
SOT223 = smd 1.219 x 2.235: 1 -2.311,-3.099; 2 0,-3.099; 3 2.311,-3.099 | smd 3.6 x 2.2: 4 0,3.099
SC70-5 = smd 0.4 x 0.7: 1 -0.65,-0.85; 2 0,-0.85; 3 0.65,-0.85; 4 0.65,0.85; 5 -0.65,0.85
MSOP08 = smd 0.3 x 1.2: 1 -0.976,-2.113; 2 -0.326,-2.113; 3 0.324,-2.113; 4 0.974,-2.113; 5 0.974,2.112; 6 0.324,2.112; 7 -0.326,2.112; 8 -0.976,2.112
0603 = smd 1.1 x 1: 1 -0.85,0; 2 0.85,0
SOT23 = smd 1 x 1.4: 1 -0.95,-1.1; 2 0.95,-1.1; 3 0,1.1
9.7ELECTRET = drill 0.6 pad 1.778: + 1.3,2; - -1.3,2
R0805 = smd 1.3 x 1.5: 1 -0.85,0; 2 0.85,0
R0805' = smd 1.3 x 1.5: 1 -0.95,0; 2 0.95,0
TS42 = smd 1.6 x 1.4: 1 -4.2,2.25; 2 4.2,2.25; 3 -4.2,-2.25; 4 4.2,-2.25; 5 -4.2,0
CAY16 = smd 0.5 x 0.65: 1 -1.2,-0.675; 2 -0.4,-0.675; 3 0.4,-0.675; 4 1.2,-0.675; 5 1.2,0.675; 6 0.4,0.675; 7 -0.4,0.675; 8 -1.2,0.675
ARDUINOR3_EXTENDED = drill 1 pad 1.676 octagon: 3V 54.61,2.54; 5V 57.15,2.54; A0 69.85,2.54; A1 72.39,2.54; A2 74.93,2.54; A3 77.47,2.54; A4 80.01,2.54; A5 82.55,2.54; AREF 42.926,50.8; D0 82.55,50.8; D1 80.01,50.8; D2 77.47,50.8; D3 74.93,50.8; D4 72.39,50.8; D5 69.85,50.8; D6 67.31,50.8; D7 64.77,50.8; D8 60.706,50.8; D9 58.166,50.8; D10 55.626,50.8; D11 53.086,50.8; D12 50.546,50.8; D13 48.006,50.8; GND 45.466,50.8; GND1 62.23,2.54; GND2 59.69,2.54; IOREF 49.53,2.54; RESERVED 46.99,2.54; RESET 52.07,2.54; SCL 37.846,50.8; SDA 40.386,50.8; VIN 64.77,2.54
HIH-4030 = smd 0.508 x 1.778: 1 -1.27,-5.08; 2 0,-5.08; 3 1.27,-5.08 | smd 2.54 x 2.286: NC 0,5.842
TEMT6000-SEN = smd 1.1 x 0.8: BASE -1.87,-0.65; EMITTER -1.87,0.65 | smd 1.1 x 1: COLLECTOR 1.86,0.01
BMP085 = smd 1.67 x 0.8: P$1 -2.065,1.27; P$2 -2.065,0; P$3 -2.065,-1.27; P$5 2.065,-1.27; P$6 2.065,0; P$7 2.065,1.27 | smd 0.8 x 1.67: P$4 0,-2.065 | smd 0.8 x 2.5: P$8 0,1.65
SC70-5L = smd 0.35 x 0.8: 1 -0.65,-0.85; 2 0,-0.85; 3 0.65,-0.85; 4 0.65,0.85; 5 -0.65,0.85
SC70 = smd 0.4 x 1.1: 1 0,0; 2 0.65,0; 3 1.3,0; 4 1.3,1.95; 5 0.65,1.95; 6 0,1.95
MQ-3 = drill 1.016: A1 -3.35,3.35; A2 -3.35,-3.35; B1 3.35,3.35; B2 3.35,-3.35; HA -4.75,0; HB 4.75,0 | hole 3: 0,0
TC33X = smd 1.2 x 1.2: 1 -1,-1.825; 3 1,-1.825 | smd 1.5 x 1.6: 2 0,1.5
87758-0216 = drill 0.9 pad 1.27: 1 0,-1; 2 0,1
MKDSN1,5/3-5,08 = drill 1.3 pad 2: 1 -7.641,0.025; 2 -2.561,0.025; 3 2.519,0.025
XBEE-SMT = smd 3.048 x 1.524: 1 0,26.086; 2 0,24.079; 3 0,22.073; 4 0,20.066; 5 0,18.059; 6 0,16.053; 7 0,14.046; 8 0,12.04; 9 0,10.033; 10 0,8.026; 11 0,6.02; 12 0,4.013; 13 0,2.007; 22 21.996,2.007; 23 21.996,4.013; 24 21.996,6.02; 25 21.996,8.026; 26 21.996,10.033; 27 21.996,12.04; 28 21.996,14.046; 29 21.996,16.053; 30 21.996,18.059; 31 21.996,20.066; 32 21.996,22.073; 33 21.996,24.079; 34 21.996,26.086; 35 21.996,28.092; 36 21.996,30.099; 37 21.996,32.106 | smd 1.524 x 3.048: 14 4.013,0; 15 6.02,0; 16 8.026,0; 17 10.033,0; 18 12.04,0; 19 14.046,0; 20 16.053,0; 21 18.059,0
XBEE-PRO = drill 0.8 pad 1.27: 1 -11,9; 2 -11,7; 3 -11,5; 4 -11,3; 5 -11,1; 6 -11,-1; 7 -11,-3; 8 -11,-5; 9 -11,-7; 10 -11,-9; 11 11,-9; 12 11,-7; 13 11,-5; 14 11,-3; 15 11,-1; 16 11,1; 17 11,3; 18 11,5; 19 11,7; 20 11,9

### Placement (x,y rotation side)
A1  1.78,50.55 0 top
A2  34.29,8.26 0 top
A3  88.9,45.09 0 top
A4  92.08,14.61 90 top
A5  92.08,11.43 90 top
ACT  31.11,3.17 180 top
ASSOC  24.77,3.17 180 top
C1  47.85,44.33 180 top
C2  47.85,30.82 180 top
C3  47.62,27.94 0 top
C4  1.0uF  [C0805K']  60.33,41.91 0 top
C5  48.26,14.61 0 top
C6  46.35,12.7 0 top
C7  52.07,14.61 180 top
C8  54.61,17.78 90 top
C9  87,14.61 0 top
C10  80.64,14.61 0 top
C11  81.66,11.94 90 top
C12  79.38,19.68 270 top
C13  16.51,10.79 270 top
D1  64.77,39.37 90 top
IC1  47.62,37.47 180 top
IC2  19.05,10.79 0 top
IC3  8.89,9.53 180 top
L1  50.16,21.59 90 top
L2  51.44,21.59 90 top
MOT  27.94,3.17 180 top
PWR  18.41,3.17 180 top
Q1  55.88,33.02 180 top
Q2  64.77,33.02 180 top
Q3  47.62,6.35 180 top
R1  73.66,15.88 0 top
R2  55.88,36.2 0 top
R3  59.05,32.38 270 top
R4  64.77,36.2 180 top
R5  61.59,32.38 90 top
R6  45.72,19.05 0 top
R7  45.72,16.51 0 top
R8  48.26,17.78 90 top
R9  50.16,12.7 180 top
R10  55.88,14.61 0 top
R11  59.05,14.61 0 top
R12  10K  [R0805']  84.45,19.68 90 top
R13  47R  [R0805']  90.17,13.34 270 top
R14  10K  [R0805']  80.64,16.51 180 top
R15  1K  [R0805']  54.61,44.45 90 top
R16  100R  [R0805']  29.21,45.72 270 top
R17  1K  [R0805']  29.21,49.53 270 top
R18  1K  [R0805']  57.78,44.45 90 top
RESET  34.67,47.75 270 top
RN1  13.34,8.89 0 top
RN2  26.67,8.89 0 top
RSSI  15.24,3.17 180 top
RX  12.06,3.17 180 top
SPARE  21.59,3.17 180 top
TX  8.89,3.17 180 top
U1  6.35,0 0 top
U2  68.58,12.7 0 top
U3  73.66,11.43 270 top
U4  60.33,38.1 270 top
U5  51.44,17.78 0 top
U6  84.45,16.51 180 top
U7  79.38,38.73 270 top
U$5  [TOP_DOCU_5MM]  52.7,23.5 0 top
U$7  [BABILIM_7.5MM]  85.09,24.77 0 top
VR1  58.42,17.78 270 top
X1  9.53,41.91 90 top
X2  16.51,48.26 180 top
XB1  40.01,15.24 90 top
XB2  24.89,29.21 90 top

### Tracks (layer width: path | path; a pad name or v marks a point on that pad's centre or on a via)
3.3V
  Top 0.254: Q1.1 56.83,36.09 R2.2 57.87,37.34 58.26,37.34 | Q2.1 65.72,36.09 R4.1 65.62,36.36 64.64,37.34 58.26,37.34 | U4.P$4 58.26,37.34 | 57.15,41.91 C4.1 | RX.A 10.57,4.22 10.54,4.19
  Top 0.406: 16,13.21 16,15.24 XB1.2 15.89,15.27 XB2.1 | 16,13.21 16,11.81 16.51,11.81 C13.1 16.51,11.64 IC2.5 | RX.A TX.A | 10.54,4.19 10.54,1.27 10.16,0.89 7.87,0.89 6.99,1.78 6.99,13.08 7.49,13.59 12.06,13.59 12.45,13.21 16,13.21
  Top 0.508: XB2.1 17.37,19.68 36.2,19.68 38.1,17.78 41.91,17.78 42.55,18.41 42.55,26.67 43.81,27.94 C3.1
  Top 0.762: C2.A 46.62,30.64 C3.1 | U4.P$3 59.05,41.64 C4.1
  Top 1.27: C2.A 46.45,33.19 IC1.4 IC1.2
  pour Top (isolate 0.305): 59.44,42.55 59.44,37.85 52.07,37.85 49.66,35.43 49.66,33.15 48.9,32.38 48.01,32.38 47.37,31.75 47.37,27.18 45.72,27.18 45.72,38.1 46.35,38.73 46.35,41.27 46.99,41.91 48.26,41.91 48.9,41.27 48.9,39.5 49.28,39.12 51.18,39.12 54.61,42.55
+5V  (via drill 0.3)
  Top 0.203: v83.19,20.57 84.39,20.57 R12.2
  Top 0.254: 45.06,41.53 45.31,41.27 | R3.2 59.09,31.5 v60.33,31.5 61.56,31.5 R5.1
  Top 0.305: IC3.8 10.49,7.41 v10.54,7.37
  Top 0.508: v63.5,9.53 69.85,9.53 | 69.85,9.53 73.62,9.53 U3.COLLECTOR | U2.3 69.85,9.53
  Top 0.762: 45.31,42.04 45.31,41.27 IC1.3 45.09,40.34 | 45.31,42.04 45.31,43.19 C1.A 46.45,44.55 48.9,46.99 75.87,46.99 U7.HA 80.78,42.09 U7.A1 | X2.1 24.15,44.43 26.67,41.91 v44.2,41.91 45.19,41.91 45.31,42.04 | U3.COLLECTOR 77.26,9.57 v80.39,12.7 81.42,12.7 C11.2 | v44.2,24.77 50.16,24.77 | 50.16,24.77 v60.33,24.77 | L1.2 50.16,24.77
  Bottom 0.254: v60.33,24.77 v60.33,31.5
  Bottom 0.305: v83.19,20.57 80.39,17.78 v80.39,12.7
  Bottom 0.762: v44.2,41.91 v44.2,24.77 44.2,10.29 41.27,7.37 v10.54,7.37 | U1.5V v63.5,9.53 63.5,21.59 v60.33,24.77
  pour Top (isolate 0.305, no thermals): 80.9,15.37 83.31,15.37 83.31,13.21 82.42,12.32 80.9,12.32
A0
  Top 0.254: U2.2 68.58,5.71 69.85,4.45 74.3,4.45 U1.A0
A1  (via drill 0.3)
  Top 0.203: R1.2 74.42,15.75 74.42,13.46 U3.EMITTER
  Top 0.254: v75.18,13.34 74.34,13.34 U3.EMITTER
  Bottom 0.254: v75.18,13.34 75.18,6.1 U1.A1
A2  (via drill 0.3)
  Top 0.254: U5.4 52.69,18.63 53.98,18.63 54.34,18.78 C8.2 VR1.1 58.92,18.78 VR1.2 v61.34,17.78 | v61.34,5.33 61.34,4.7 62.23,3.81 62.23,1.91 62.87,1.27 80.01,1.27 U1.A2
  Bottom 0.254: v61.34,17.78 v61.34,5.33
A3  (via drill 0.3)
  Top 0.254: R14.2 v78.49,16.51
  Top 0.406: R14.2 79.69,18.11 C12.2
  Bottom 0.254: U1.A3 78.49,7.87 v78.49,16.51 78.49,16.89 82.72,21.13 U7.B1
AGND
  pour Top (isolate 0.305, no thermals): 51.82,21.21 51.82,5.42 49.57,3.17 47.62,3.17 47.62,5.08 50.42,7.87 50.42,13.84 48.64,13.84 48.64,15.37 51.05,15.37 51.05,21.21
ARDUINO-RX(0)  (via drill 0.3)
  Top 0.254: U1.D0 87,52.7 43.81,52.7 42.93,51.82 42.93,49.28 41.91,48.26 32.89,48.26 31.37,49.78 31.37,51.82 30.48,52.7 18.29,52.7 16.89,51.31 v16.89,43.18 | IC3.3 8.57,12.38 8.76,12.57 15.11,12.57 15.37,12.32 15.37,10.97 15.55,10.79 18.69,10.79 19.05,11.15 19.05,13.46 17.93,14.58 XB1.3
  Top 0.406: XB2.2 17.89,15.99 17.78,15.88 17.78,15.39 XB1.3
  Bottom 0.254: XB2.2 17.89,38.5 16.89,39.5 v16.89,43.18
ARDUINO-TX(1)  (via drill 0.3)
  Top 0.254: U1.D1 85.09,52.07 45.97,52.07 45.47,51.56 45.47,50.09 43,47.62 32.64,47.62 30.86,49.4 30.86,51.05 29.84,52.07 18.41,52.07 17.4,51.05 17.4,44.58 v18.8,43.18 | IC2.2 v19.05,8.89 17.65,8.89 17.4,8.64 15.62,8.64 15.37,8.89 11.68,8.89 11.3,8.51 11.3,6.6 11.05,6.35 8.26,6.35 7.92,6.69 IC3.5
  Bottom 0.254: v19.05,8.89 19.05,17.27 18.92,17.4 18.92,43.05 v18.8,43.18
DIO_4  (via drill 0.3)
  Top 0.254: v85.72,18.67 84.52,18.67 R12.1
  Top 0.305: R12.1 84.65,18.73
  Top 0.356: U6.1 84.45,17.02 84.58,17.14 84.58,18.61 R12.1
  Bottom 0.254: v85.72,18.67 85.72,43.81 U1.D4
DIO_5  (via drill 0.3)
  Top 0.254: D1.C v64.77,41.53
  Bottom 0.254: U1.D5 66.93,41.53 v64.77,41.53
DIO_6
  Top 0.254: R16.2 44.64,44.77 47.62,47.88 70.61,47.88 U1.D6
DIO_8  (via drill 0.3)
  Top 0.254: U1.D8 64.64,48.39 46.99,48.39 v44.07,45.47 | RN2.8 25.47,10.76 26.77,12.06 v42.8,12.06
  Bottom 0.254: v44.07,45.47 42.8,44.2 v42.8,12.06
DIO_9  (via drill 0.3)
  Top 0.254: RN2.5 27.87,10.22 28.19,10.54 v41.91,10.54 | v42.93,45.47 46.35,48.9 62.61,48.9 U1.D9
  Bottom 0.254: v41.91,10.54 41.91,44.45 v42.93,45.47
DIO_10  (via drill 0.3)
  Top 0.254: RN2.6 27.07,10.56 27.94,11.43 v41.27,11.43 | v42.55,46.35 45.72,49.53 60.71,49.53 U1.D10
  Bottom 0.254: v41.27,11.43 41.27,45.09 v42.55,46.35
DIO_11  (via drill 0.3 pad 0.3)
  Top 0.254: R18.2 59.12,45.4 v59.18,45.47
  Bottom 0.254: U1.D11 59.44,45.72 v59.18,45.47
DIO_12  (via drill 0.3)
  Top 0.254: R15.2 55.81,45.4 v55.88,45.47
  Bottom 0.254: U1.D12 56.9,46.48 v55.88,45.47
EOC  (via drill 0.3)
  Top 0.254: U4.P$2 v60.33,43.18
  Bottom 0.254: U1.D7 71.12,47.62 68.58,45.09 62.23,45.09 v60.33,43.18
GND  (via drill 0.3)
  Top 0.254: IC3.4 7.92,12.66 v7.87,12.7 | v67.31,6.1 U2.1 | v72.9,17.14 72.9,15.96 R1.1 | 79.33,20.64 C12.1 | 16.51,9.95 16.17,10.16 v15.24,10.16 | v20.45,9.78 19.87,9.78 IC2.3
  Top 0.356: U6.5 83.81,13.48 v83.82,13.46 | v83.82,17.53 83.82,16.52 U6.2 | C11.1 82.92,10.94 v82.93,10.92 | v81.66,9.78 81.66,10.41 81.15,10.92 v80.39,10.92 | v79.63,13.34 79.63,14.59 C10.1
  Top 0.406: X2.3 10.9,48.23 8.51,45.85 8.51,41.93 X1.2 | v32.38,50.67 RESET.3 | RESET.4 31.12,43.55 v31.11,43.56 | v27.94,50.42 29.27,50.42 R17.1 | IC2.1 16.51,9.95 C13.2 | RSSI.C v15.24,1.02 | PWR.C v18.41,1.02 | SPARE.C v21.59,1.02 | ASSOC.C v24.77,1.02 | MOT.C v27.94,1.02 | ACT.C v31.11,1.02 | v80.77,20.32 79.49,20.32 C12.1
  Top 0.508: 38.1,15.14 XB1.13
  Top 0.762: C1.C 49.91,43.66 v49.91,42.42 49.91,40.59 IC1.1 | L2.2 v51.44,23.5 | v61.59,43.18 61.59,41.91 | 61.59,41.91 U4.P$1 | C4.2 61.59,41.91 | v39.24,14.73 37.97,14.73 37.97,15.21 XB1.13
  Top 1.27: C2.C 48.64,30.21 v48.64,29.21 48.64,27.96 C3.2
  other vias: 5.71,1.27 84.84,12.7 85.72,12.7 87,12.7 88.27,12.7 88.77,12.06 88.9,16.51 90.17,16.51 91.44,16.51 92.71,16.51 87,16.76 88.01,16.76 39.37,8.89 38.1,8.89 36.83,8.89 31.11,8.89 29.84,8.89 36.83,40.01 35.56,40.01
  pour Bottom (isolate 0.305): -0.64,54.61 94.61,54.61 94.61,-1.27 -0.64,-1.27
  pour Top (isolate 0.305, no thermals): 89.41,12.95 92.46,12.95 92.96,12.45 92.96,11.68 92.46,11.18 89.41,11.18
  pour Top (isolate 0.305, rank 2): -1.27,53.98 95.25,53.98 95.25,-1.27 -1.27,-1.27
N$1
  Top 0.406: TX.C 8.67,2.12 7.62,3.17 7.62,5.08 8,5.46 11.18,5.46 12.13,6.42 RN1.1
N$2
  Top 0.762: R7.1 44.87,13.19 C6.1 45.35,5.32 Q3.+
N$6
  Top 0.254: 48.26,12.7 R8.1 48.71,16.93 U5.1 | 48.26,12.7 R9.2 | C6.2 48.26,12.7
N$7
  Top 0.254: R6.1 44.87,18.38 46.57,16.68 R7.2 47.26,15.82 C5.1
N$8
  Top 0.254: R11.1 R10.2 56.73,14.77 54.72,16.78 C8.1 54.31,16.93 U5.3
N$9
  Top 0.254: R10.1 C7.1
N$10
  Top 0.254: R11.2 59.91,14.77 57.9,16.78 VR1.3
N$11
  Top 0.406: RN2.4 27.87,7.47 ACT.A
N$12
  Top 0.406: U6.6 85.95,14.56 C9.1
N$13
  pour Top (isolate 0.305, no thermals): 87.38,13.84 92.46,13.84 92.84,14.22 92.84,14.99 92.46,15.37 87.38,15.37
N$14
  Top 0.356: U6.3 R14.1
N$15
  Top 0.406: RN2.3 27.07,5.09 MOT.A
N$16
  Top 0.406: RN1.3 13.73,5.73 RSSI.A
N$17
  cutout Bottom: 93.98,15.88 84.2,15.88 84.2,13.34 93.98,13.34
N$18
  Top 0.406: RN2.2 26.27,5.73 ASSOC.A
N$19
  Top 0.406: RN2.1 25.47,8.11 SPARE.A
N$20
  Top 0.406: R16.1 R17.2 28.89,48.9 27.3,48.9 26.04,50.16 21,50.16 X2.2
N$21
  cutout Top (isolate 0.305, rank 2): 93.98,15.88 93.98,15.49 87.12,15.49 87.12,13.72 93.98,13.72 93.98,13.34 84.2,13.34 84.2,15.88
N$29
  Top 0.406: RN1.4 14.54,8.11 PWR.A
N$191
  Top 0.406: RN1.2 12.94,5.35 13.21,5.08 13.21,3.27 RX.C
RESET  (via drill 0.3)
  Top 0.254: v38.1,51.94 RESET.1 | RESET.2 v38.1,43.56 v44.2,43.56
  Bottom 0.254: v38.1,43.56 v38.1,51.94 | v44.2,43.56 44.96,42.8 44.96,2.92 46.99,0.89 56.77,0.89 U1.RESET
RSSI  (via drill 0.3)
  Top 0.254: 26.04,15.16 XB1.7 | v13.72,10.41 13.72,9.58 RN1.6 | v25.91,20.7 v13.72,20.7 | 25.89,15.31 XB2.6
  Top 0.406: 25.89,15.31 XB1.7
  Bottom 0.254: XB2.6 25.89,20.68 v25.91,20.7 | v13.72,20.7 v13.72,10.41
RX3
  Top 0.406: XB2.3 19.89,15.29 XB1.4 19.94,12.83 19.7,12.59 IC2.4
RXB
  Top 0.254: RN1.7 12.94,10.05 12.7,10.29 9.91,10.29 | 9.91,10.29 9.53,10.29 9.22,10.6 IC3.2 | IC3.1 9.87,10.33 9.91,10.29
SCL_3.3V
  Top 0.254: R2.1 54.93,36.09 Q1.2 55.24,33.8 55.24,33.53 55.75,33.02 57.43,33.02 57.78,33.38 57.78,34.04 58.04,34.29 59.69,34.29 60.33,34.92 U4.P$6
SCL_5.0V  (via drill 0.3)
  Top 0.254: R3.1 58.84,33.02 58.55,33.02 57.45,31.92 Q1.3 55.08,31.92 53.34,33.66 v53.34,36.2
  Bottom 0.254: v53.34,36.2 53.34,44.96 48.01,50.29 48.01,51.69 47.62,52.07 45.47,52.07 U1.SCL
SDA_3.3V
  Top 0.254: Q2.2 63.82,36.09 R4.2 63.76,36.03 U4.P$7
SDA_5.0V  (via drill 0.3)
  Top 0.254: Q2.3 63.2,31.92 | 63.2,31.92 62.1,33.02 61.81,33.02 R5.2 | v52.07,36.2 52.07,33.02 54.61,30.48 62.74,30.48 63.2,30.95 63.2,31.92
  Bottom 0.254: v52.07,36.2 52.07,45.47 U1.SDA
TXB
  Top 0.254: RN1.8 9.56,9.56 9.22,9.22 9.22,8.51 | IC3.7 9.22,8.51 | IC3.6 8.57,8.44 8.64,8.51 9.22,8.51
VCC
  Top 0.254: U5.5 50.16,18.63 50.16,18.41 48.26,18.41 R8.2
  pour Top (isolate 0.254, no thermals): 50.55,21.21 50.55,18.03 45.97,18.03 45.97,19.86 47.32,21.21
XB_AD0
  Top 0.406: XB1.33 15.89,37.27 XB2.20 14.19,41.91 X1.1
XB_AD1
  Top 0.406: XB2.19 17.89,37.28 XB1.32
XB_AD2
  Top 0.406: XB2.18 19.89,37.28 XB1.31
XB_AD3
  Top 0.406: XB2.17 21.89,37.29 XB1.30
XB_AD4
  Top 0.406: XB2.11 33.89,37.33 XB1.24
XB_ASSOC  (via drill 0.3)
  Top 0.254: v26.29,10.41 26.29,9.58 RN2.7
  Top 0.406: XB2.15 25.89,37.3 XB1.28
  Bottom 0.254: v26.29,10.41 26.29,16.64 26.92,17.27 26.92,39.18 XB2.15
XB_CTS
  Top 0.406: XB2.12 31.89,37.32 XB1.25
XB_DIO12
  Top 0.406: XB2.4 21.89,15.29 XB1.5
XB_DTR
  Top 0.406: XB2.9 31.89,15.33 XB1.10
XB_RESET
  Top 0.406: XB2.5 23.89,15.3 XB1.6
XB_RTS
  Top 0.406: XB2.16 23.89,37.3 XB1.29
XB_VREF
  Top 0.406: XB2.14 27.89,37.31 XB1.27
XBEE_ON  (via drill 0.3)
  Top 0.254: v14.48,10.79 14.48,9.62 RN1.5 | v14.48,21.59 v29.97,21.59
  Top 0.406: XB2.13 29.89,37.32 XB1.26
  Bottom 0.254: v14.48,10.79 v14.48,21.59 | v29.97,21.59 29.97,40.01 | 29.97,40.01 29.97,40.13 | XB2.13 29.89,40.09 29.97,40.01
XCLR_3.3V
  Top 0.254: U4.P$8 64.5,38.1 D1.A

### Text on the board
tPlace: GND | MAT | +5V | MAT | AQ | babilim light | industries, ltd | SensorMoteSMT_V1.1 | kippkitts, llc | Google I/O 2013 | With | O'Reilly Strata | Digi and Google | RF | BUILD:
tNames: 20 | 1 | 10